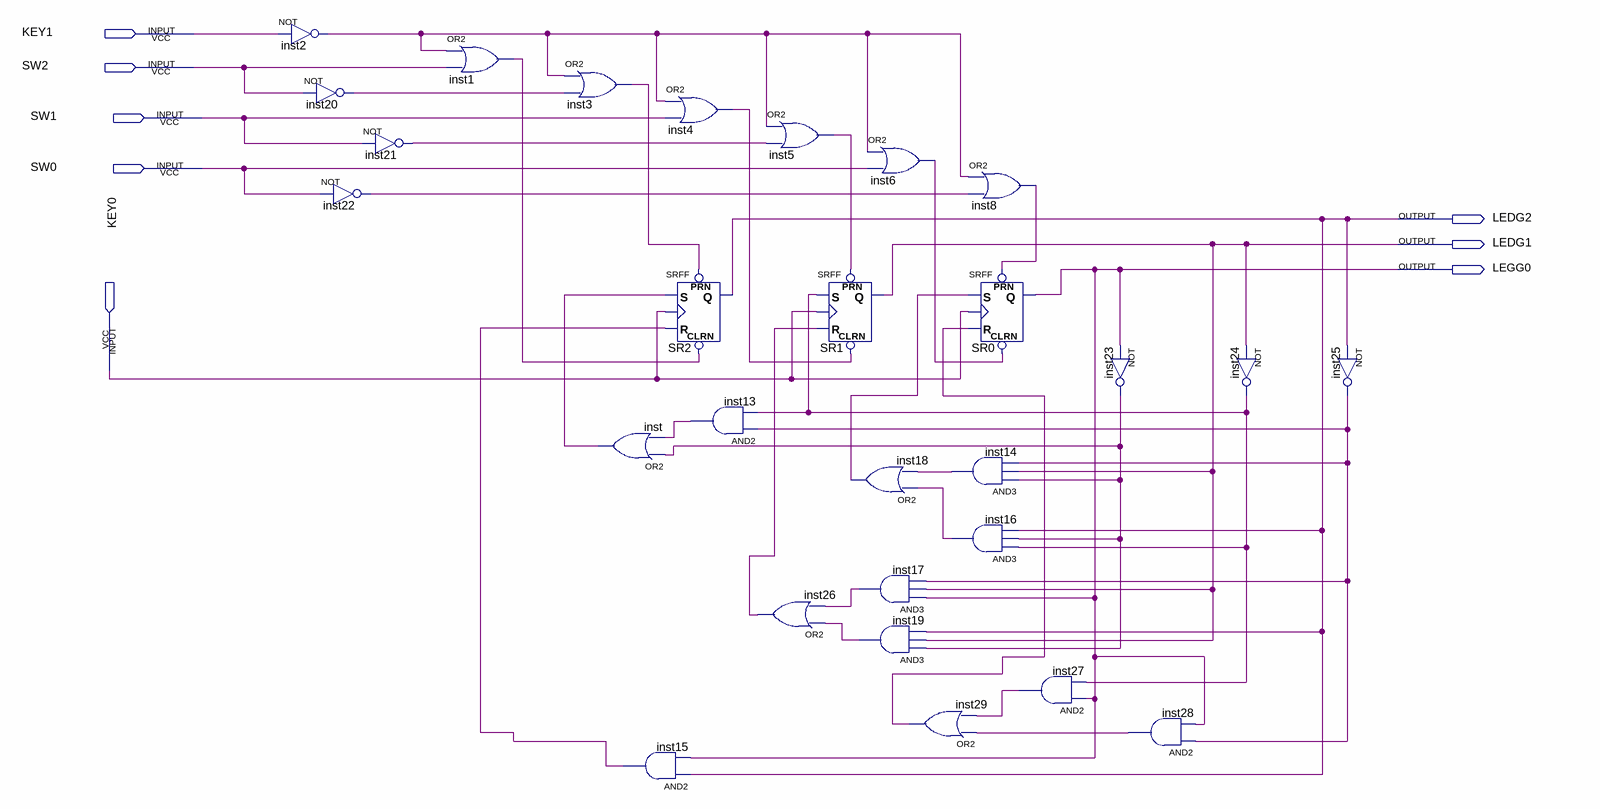
[diagram p0: schematic sheet]
// Quartus schematic test_quartus_new.bdf as structural Verilog: 28 symbols, 8 pins
module test_quartus_new (
  input  KEY1,
  input  SW2,
  input  SW1,
  input  SW0,
  input  KEY0,
  output LEDG2,
  output LEDG1,
  output LEGG0
);

  wire inst1_out, inst2_out, inst3_out, inst4_out, inst5_out, inst6_out, inst8_out, inst13_out, inst14_out,
       inst15_out, inst16_out, inst17_out, inst18_out, inst19_out, inst20_out, inst21_out, inst22_out,
       inst23_out, inst24_out, inst25_out, inst26_out, inst27_out, inst28_out, inst29_out, inst_out;

  not inst2 (inst2_out, KEY1);
  not inst20 (inst20_out, SW2);
  not inst22 (inst22_out, SW0);
  not inst21 (inst21_out, SW1);
  or inst1 (inst1_out, inst2_out, SW2);
  or inst3 (inst3_out, inst2_out, inst20_out);
  or inst (inst_out, inst23_out, inst13_out);
  or inst4 (inst4_out, inst2_out, SW1);
  SRFF SR2 (.PRN(inst3_out), .CLRN(inst1_out), .S(inst_out), .R(inst15_out), .CLK(KEY0), .Q(LEDG2));
  and inst15 (inst15_out, LEDG2, LEGG0);
  and inst13 (inst13_out, inst25_out, inst24_out);
  or inst5 (inst5_out, inst2_out, inst21_out);
  or inst26 (inst26_out, inst19_out, inst17_out);
  or inst6 (inst6_out, inst2_out, SW0);
  SRFF SR1 (.PRN(inst5_out), .CLRN(inst4_out), .S(inst24_out), .R(inst26_out), .CLK(KEY0), .Q(LEDG1));
  or inst18 (inst18_out, inst16_out, inst14_out);
  and inst17 (inst17_out, LEGG0, LEDG1, inst25_out);
  and inst19 (inst19_out, inst23_out, LEDG1, LEDG2);
  or inst29 (inst29_out, inst28_out, inst27_out);
  or inst8 (inst8_out, inst2_out, inst22_out);
  SRFF SR0 (.PRN(inst8_out), .CLRN(inst6_out), .S(inst18_out), .R(inst29_out), .CLK(KEY0), .Q(LEGG0));
  and inst14 (inst14_out, inst23_out, LEDG1, inst25_out);
  and inst16 (inst16_out, inst24_out, inst23_out, LEDG2);
  and inst27 (inst27_out, LEGG0, inst24_out);
  not inst23 (inst23_out, LEGG0);
  and inst28 (inst28_out, inst25_out, LEGG0);
  not inst24 (inst24_out, LEDG1);
  not inst25 (inst25_out, LEDG2);
endmodule
